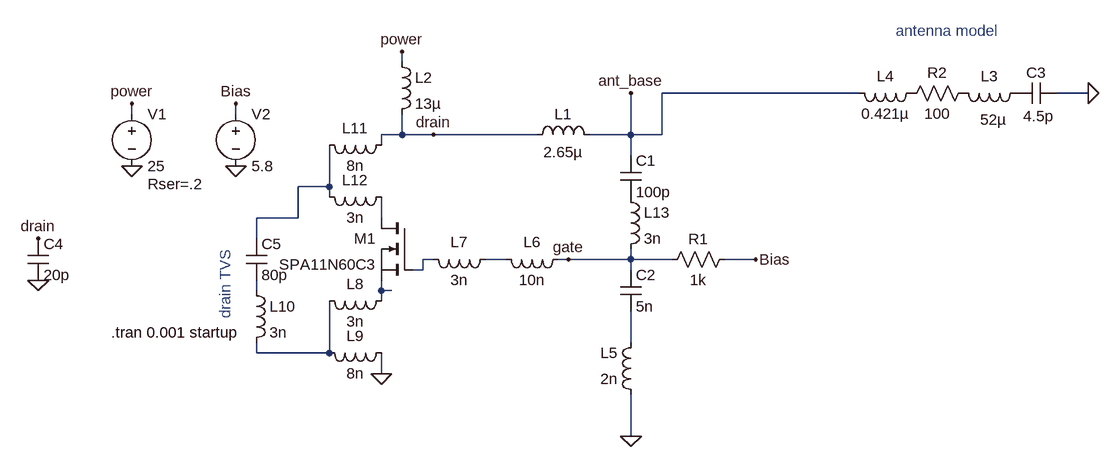
[diagram p0: schematic Mhz10-Plasma_flame_ex1.asc]
Mhz10-Plasma_flame_ex1.asc, the LTspice schematic file:
Version 4
SHEET 1 1416 680
WIRE 240 -96 240 -112
WIRE 944 -48 640 -48
WIRE 1296 -48 1248 -48
WIRE -176 -16 -176 -32
WIRE -16 -16 -16 -32
WIRE 240 16 240 -16
WIRE 240 16 208 16
WIRE 288 16 240 16
WIRE 448 16 288 16
WIRE 592 16 592 -48
WIRE 592 16 528 16
WIRE 640 16 640 -48
WIRE 640 16 592 16
WIRE 208 32 208 16
WIRE 592 48 592 16
WIRE 128 96 128 32
WIRE 128 96 80 96
WIRE 128 112 128 96
WIRE 80 144 80 96
WIRE 80 144 16 144
WIRE 208 144 208 112
WIRE 16 176 16 144
WIRE 288 208 272 208
WIRE 400 208 368 208
WIRE 496 208 480 208
WIRE 592 208 592 192
WIRE 592 208 496 208
WIRE 656 208 592 208
WIRE 784 208 736 208
WIRE 272 224 272 208
WIRE 272 224 256 224
WIRE 592 224 592 208
WIRE 16 256 16 240
WIRE 208 256 208 240
WIRE 224 256 208 256
WIRE 208 272 208 256
WIRE 592 336 592 288
WIRE 16 352 16 336
WIRE 128 352 128 272
WIRE 128 352 16 352
WIRE 208 384 208 352
WIRE 592 480 592 416
FLAG -176 -32 power
FLAG 240 -112 power
FLAG -176 64 0
FLAG -16 -32 Bias
FLAG -16 64 0
FLAG 784 208 Bias
FLAG 1296 -48 0
FLAG 592 -48 ant_base
FLAG 496 208 gate
FLAG 288 16 drain
FLAG 592 480 0
FLAG 208 384 0
FLAG -320 176 drain
FLAG -320 240 0
SYMBOL nmos 256 144 M0
SYMATTR InstName M1
SYMATTR Value SPA11N60C3
SYMBOL ind 432 32 R270
WINDOW 0 32 56 VTop 2
WINDOW 3 5 56 VBottom 2
SYMATTR InstName L1
SYMATTR Value 2.65µ
SYMATTR SpiceLine Rser=150m
SYMBOL cap 576 48 R0
SYMATTR InstName C1
SYMATTR Value 100p
SYMATTR SpiceLine Rser=.01
SYMBOL voltage -176 -32 R0
WINDOW 123 0 0 Left 0
WINDOW 39 24 124 Left 2
SYMATTR SpiceLine Rser=.2
SYMATTR InstName V1
SYMATTR Value 25
SYMBOL voltage -16 -32 R0
WINDOW 123 0 0 Left 0
WINDOW 39 0 0 Left 0
SYMATTR InstName V2
SYMATTR Value 5.8
SYMBOL cap 576 224 R0
SYMATTR InstName C2
SYMATTR Value 5n
SYMATTR SpiceLine Rser=.1
SYMBOL ind 224 -112 R0
SYMATTR InstName L2
SYMATTR Value 13µ
SYMATTR SpiceLine Rser=50m
SYMBOL res 752 192 R90
WINDOW 0 0 56 VBottom 2
WINDOW 3 32 56 VTop 2
SYMATTR InstName R1
SYMATTR Value 1k
SYMBOL cap 1248 -64 R90
WINDOW 0 0 32 VBottom 2
WINDOW 3 36 28 VTop 2
SYMATTR InstName C3
SYMATTR Value 4.5p
SYMBOL ind 1200 -64 R90
WINDOW 0 5 56 VBottom 2
WINDOW 3 41 50 VTop 2
SYMATTR InstName L3
SYMATTR Value 52µ
SYMBOL res 1120 -64 R90
WINDOW 0 0 56 VBottom 2
WINDOW 3 32 56 VTop 2
SYMATTR InstName R2
SYMATTR Value 100
SYMBOL ind 1040 -64 R90
WINDOW 0 5 56 VBottom 2
WINDOW 3 32 56 VTop 2
SYMATTR InstName L4
SYMATTR Value 0.421µ
SYMBOL ind 496 192 R90
WINDOW 0 5 56 VBottom 2
WINDOW 3 32 56 VTop 2
SYMATTR InstName L6
SYMATTR Value 10n
SYMATTR SpiceLine Rser=1m
SYMBOL ind 608 432 R180
WINDOW 0 36 80 Left 2
WINDOW 3 36 40 Left 2
SYMATTR InstName L5
SYMATTR Value 2n
SYMATTR SpiceLine Rser=1m
SYMBOL cap 0 176 R0
SYMATTR InstName C5
SYMATTR Value 80p
SYMBOL ind 224 256 R90
WINDOW 0 5 56 VBottom 2
WINDOW 3 32 56 VTop 2
SYMATTR InstName L8
SYMATTR Value 3n
SYMBOL ind 224 336 R90
WINDOW 0 5 56 VBottom 2
WINDOW 3 32 56 VTop 2
SYMATTR InstName L9
SYMATTR Value 8n
SYMBOL ind 0 240 R0
SYMATTR InstName L10
SYMATTR Value 3n
SYMBOL ind 224 16 R90
WINDOW 0 5 56 VBottom 2
WINDOW 3 32 56 VTop 2
SYMATTR InstName L11
SYMATTR Value 8n
SYMBOL ind 224 96 R90
WINDOW 0 5 56 VBottom 2
WINDOW 3 32 56 VTop 2
SYMATTR InstName L12
SYMATTR Value 3n
SYMBOL ind 384 192 R90
WINDOW 0 5 56 VBottom 2
WINDOW 3 32 56 VTop 2
SYMATTR InstName L7
SYMATTR Value 3n
SYMBOL cap -336 176 R0
SYMATTR InstName C4
SYMATTR Value 20p
SYMBOL ind 576 96 R0
SYMATTR InstName L13
SYMATTR Value 3n
SYMATTR SpiceLine Rser=50m
TEXT -208 320 Left 2 !.tran 0.001 startup
TEXT 1000 -144 Left 2 ;antenna model
TEXT -32 192 VRight 2 ;drain TVS

The netlist it stands for:
* Mhz10-Plasma_flame_ex1.asc
M1 N002 N003 N006 N006 SPA11N60C3
L1 drain ant_base 2.65µ Rser=150m
C1 ant_base P001 100p Rser=.01
V1 power 0 25 Rser=.2
V2 Bias 0 5.8
C2 gate N007 5n Rser=.1
L2 power drain 13µ Rser=50m
R1 Bias gate 1k
C3 0 P002 4.5p
L3 P002 P003 52µ
R2 P003 P004 100
L4 P004 ant_base 0.421µ
L6 gate N004 10n Rser=1m
L5 0 N007 2n Rser=1m
C5 N001 N005 80p
L8 N006 N008 3n
L9 0 N008 8n
L10 N005 N008 3n
L11 drain N001 8n
L12 N002 N001 3n
L7 N004 N003 3n
C4 drain 0 20p
L13 P001 gate 3n Rser=50m
.model NMOS NMOS
.model PMOS PMOS
.lib standard.mos
.tran 0.001 startup
* antenna model
* drain TVS
.backanno
.end